# Altium project Flir_brake_out.PrjPcb
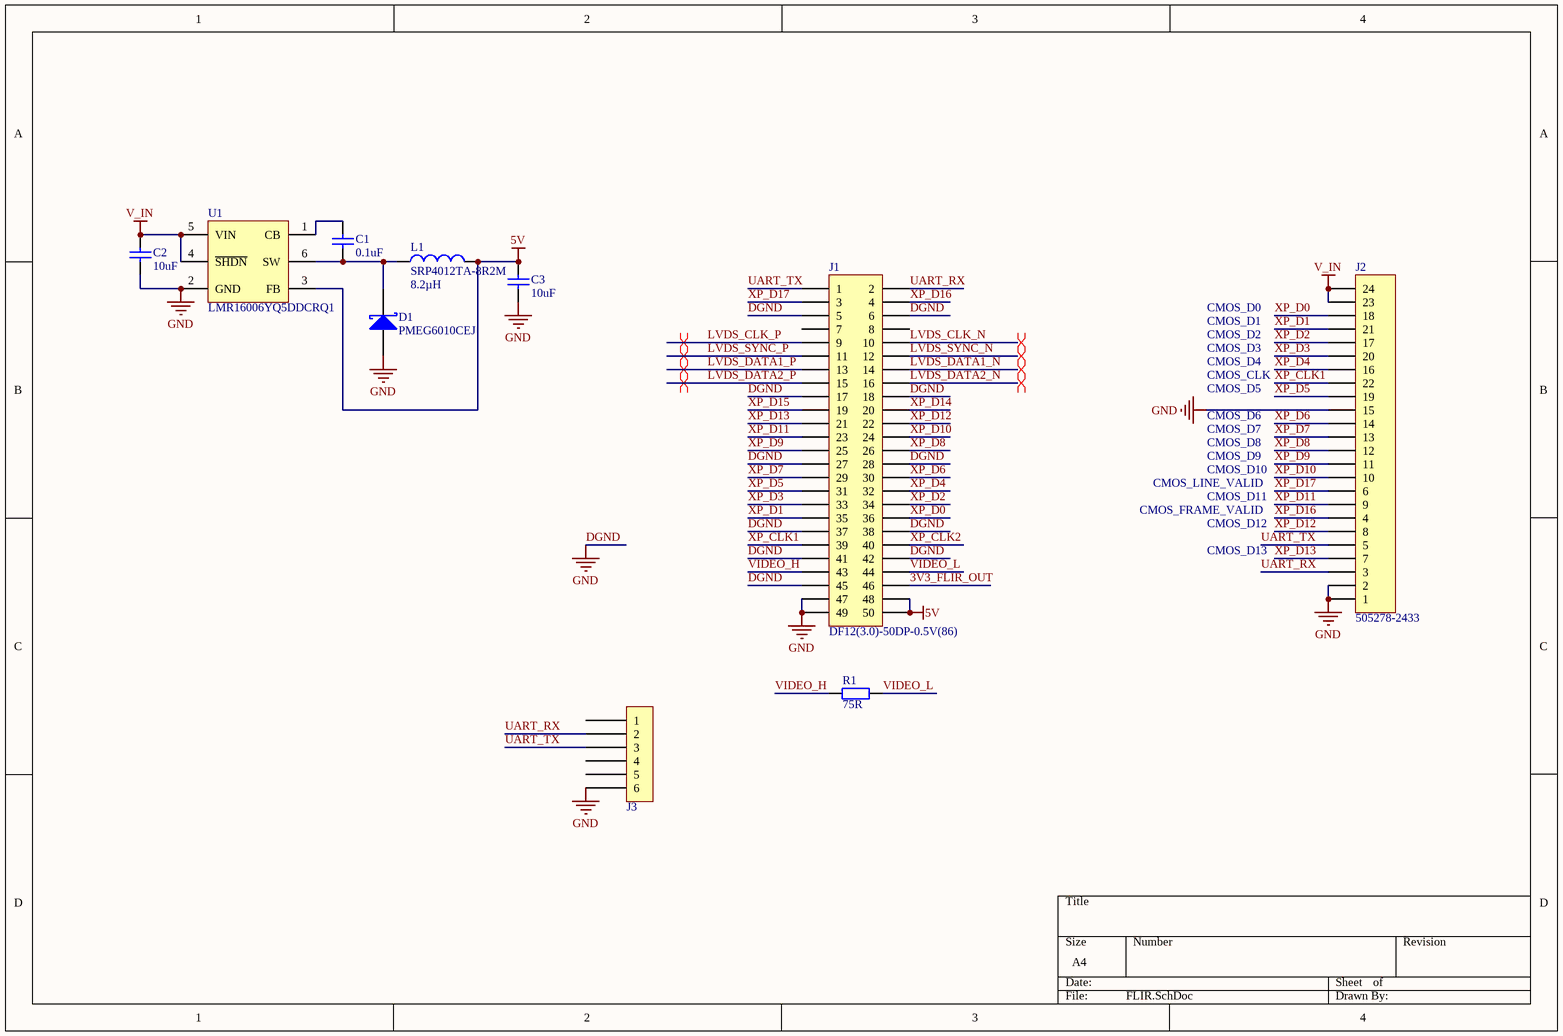
[diagram p0: FLIR.SchDoc]
1 sheet, 10 parts. Net scope: global (net labels, ports and power ports of the same name join across sheets).
Board files: Flir_PCB.PcbDoc, Flir_PCB_Panel(90x90).PcbDoc

## Sheet FLIR.SchDoc
size A4

### Parts
C1  value 0.1uF  [0603C_L]  (hidden comment: VJ0603Y104JXJPW1BC)
C2  value 10uF  [1206_1.6_L]  (hidden comment: GRM31CR61H106MA12L)
C3  value 10uF  [1206_1.6_L]  (hidden comment: TMK316B7106KL-TD)
D1  PMEG6010CEJ  [SOD323M]
J1  DF12(3.0)-50DP-0.5V(86)  [DF12(3.0)-50DP-0.5V(86)]
J2  505278-2433  [505278-2433]
J3  BM06B-GHS-TBT(LF)(SN)(N)  [BM06B-GHS-TBT]  (value not drawn)
L1  SRP4012TA-8R2M  Inductance: 8.2µH  [INDP4541X12M]
R1  value 75R  [0603R_0.45_H]  (hidden comment: CRCW060375R0FKEA)
U1  LMR16006YQ5DDCRQ1  [SOT95P280X110-6M]

### Nets
5V: C3.2 J1.48 J1.50 L1.2 U1.3(FB)
DGND: C2.1 C3.1 D1.2(A) J1.5 J1.6 J1.17 J1.18 J1.27 J1.28 J1.37 J1.38 J1.41 J1.42 J1.45 J1.47 J1.49 J2.1 J2.2 J2.15 J3.6 U1.2(GND)  [also labelled GND]
V_IN: C2.2 J2.23 J2.24 U1.4(~{SHDN}) U1.5(VIN)
3V3_FLIR_OUT: J1.46
LVDS_CLK_N: J1.10
LVDS_CLK_P: J1.9
LVDS_DATA1_N: J1.14
LVDS_DATA1_P: J1.13
LVDS_DATA2_N: J1.16
LVDS_DATA2_P: J1.15
LVDS_SYNC_N: J1.12
LVDS_SYNC_P: J1.11
UART_RX: J1.2 J2.3 J3.2
UART_TX: J1.1 J2.5 J3.3
VIDEO_H: J1.43 R1.1
VIDEO_L: J1.44 R1.2
XP_CLK1: J1.39 J2.22
XP_CLK2: J1.40
XP_D0: J1.36 J2.18
XP_D1: J1.35 J2.21
XP_D2: J1.34 J2.17
XP_D3: J1.33 J2.20
XP_D4: J1.32 J2.16
XP_D5: J1.31 J2.19
XP_D6: J1.30 J2.14
XP_D7: J1.29 J2.13
XP_D8: J1.26 J2.12
XP_D9: J1.25 J2.11
XP_D10: J1.24 J2.10
XP_D11: J1.23 J2.9
XP_D12: J1.22 J2.8
XP_D13: J1.21 J2.7
XP_D14: J1.20
XP_D15: J1.19
XP_D16: J1.4 J2.4
XP_D17: J1.3 J2.6
NetC1_1: C1.1 D1.1(K) L1.1 U1.6(SW)
NetC1_2: C1.2 U1.1(CB)

Not connected (* = marked no-connect by the designer): J1 7 8; J3 1 4 5

### Layout directives
differential pair: LVDS_CLK_N, LVDS_CLK_P, LVDS_DATA1_N, LVDS_DATA1_P, LVDS_DATA2_N, LVDS_DATA2_P, LVDS_SYNC_N, LVDS_SYNC_P

### Notes on the sheet
- CMOS_D0
- CMOS_D1
- CMOS_D2
- CMOS_D3
- CMOS_D4
- CMOS_CLK
- CMOS_D5
- CMOS_D6
- CMOS_D7
- CMOS_D8
- CMOS_FRAME_VALID
- CMOS_LINE_VALID
- CMOS_D9
- CMOS_D10
- CMOS_D11
- CMOS_D12
- CMOS_D13

### Library data of the parts
C1 = VJ0603Y104JXJPW1BC: CAP CER 0603 0.1uF 16V X7R 5%; Manufacturer: Vishay / Vitramon; Type: Ultra Small Commodity MLCCs; Voltage Rating DC: 16 VDC; Supplier 1: Mouser; Manufacturer Part Number: VJ0603Y104JXJPW1BC; RoHS: RoHS Compliant; Category: Multilayer Ceramic Capacitors MLCC - SMD/SMT; Stock 1: 30210; Pricing 1: 1=0.091, 50=0.022, 100=0.017, 500=0.015, 1000=0.014, 15000=0.011, 75000=0.010 (EUR); Height: 0.95 mm; Length: 1.6 mm; Package/Case: 0603 (1608 metric); Packaging: Reel; Product: General Type MLCCs; Series: VJ W1BC; Termination Style: SMD/SMT; Tolerance: 5 %; Voltage Rating AC: -; Width: 0.8 mm; Brand: Vishay / Vitramon; Case Code - in: 0603; Case Code - mm: 1608; Dielectric: X7R; Maximum Operating Temperature: + 125 C; Minimum Operating Temperature: - 55 C; Standard Pack Qty: 15000; RoHS - Mouser: Y; Minimum Order Quantity: 1; Reeling: True; ComponentLink1URL: http://www.mouser.com/ds/2/427/vjw1bcbascomseries-223529.pdf; ComponentLink1Description: http://www.mouser.com/ds/2/427/vjw1bcbascomseries-223529.pdf; Supplier Part Number 1: 77-VJ0603Y104JXJPBC; Capacitance: 0.1 uF
C2 = GRM31CR61H106MA12L: CAP CER 1206 10uF 50V X5R 20%; Manufacturer: Murata Electronics; Type: General Purpose Ceramic Capacitors; Voltage Rating DC: 50 VDC; Class: Class 2; Product Status: New Product; Supplier 1: Mouser; Supplier Part Number 1: 81-GRM31CR61H106MA2L; Manufacturer Part Number: GRM31CR61H106MA12L; RoHS: RoHS Compliant; Category: Multilayer Ceramic Capacitors MLCC - SMD/SMT; Stock 1: 0; Pricing 1: 1=0.308, 10=0.168, 100=0.110, 500=0.100, 1000=0.091, 2000=0.063, 10000=0.062, 24000=0.060, 50000=0.053 (EUR); Capacitance: 10 uF; Height: 1.6 mm; Length: 3.2 mm; Package/Case: 1206 (3216 metric); Packaging: Reel; Product: General Type MLCCs; Series: GRM; Termination Style: SMD/SMT; Tolerance: 20 %; Width: 1.6 mm; Brand: Murata Electronics; Case Code - in: 1206; Case Code - mm: 3216; Dielectric: X5R; Maximum Operating Temperature: + 85 C; Minimum Operating Temperature: - 55 C; Standard Pack Qty: 2000; RoHS - Mouser: Y; Minimum Order Quantity: 1; Reeling: True; ComponentLink1URL: http://www.mouser.com/ds/2/281/c02e-2905.pdf; ComponentLink1Description: http://www.mouser.com/ds/2/281/c02e-2905.pdf
C3 = TMK316B7106KL-TD: CAP CER 1206 10uF 25V X7R 10%; Manufacturer: Taiyo Yuden; Type: Multilayer Ceramic Capacitor; Voltage Rating DC: 25 VDC; Qualification: AEC-Q200; Supplier 1: Mouser; Supplier Part Number 1: 963-TMK316B7106KL-TD; Manufacturer Part Number: TMK316B7106KL-TD; RoHS: RoHS Compliant; Category: Multilayer Ceramic Capacitors MLCC - SMD/SMT; Stock 1: 113143; Pricing 1: 1=0.434, 10=0.230, 100=0.135, 500=0.105, 1000=0.082, 2000=0.063, 4000=0.059, 10000=0.055, 24000=0.052 (EUR); Capacitance: 10 uF; Height: 1.6 mm; Length: 3.2 mm; Package/Case: 1206 (3216 metric); Packaging: Reel; Product: General Type MLCCs; Series: M; Termination Style: SMD/SMT; Tolerance: 10 %; Width: 1.6 mm; Brand: Taiyo Yuden; Case Code - in: 1206; Case Code - mm: 3216; Dielectric: X7R; Maximum Operating Temperature: + 125 C; Minimum Operating Temperature: - 55 C; Standard Pack Qty: 2000; RoHS - Mouser: Y; Minimum Order Quantity: 1; Reeling: True; ComponentLink1URL: http://www.mouser.com/ds/2/396/mlcc_all_e-541559.pdf; ComponentLink1Description: http://www.mouser.com/ds/2/396/mlcc_all_e-541559.pdf
D1 = PMEG6010CEJ,115: DIODE SCHOTTKY 60V 1A SOD323F; Manufacturer: NXP USA Inc.; Current - Average Rectified (Io): 1A (DC); Voltage - Forward (Vf) (Max) @ If: 660mV @ 1A; Speed: Fast Recovery =< 500ns, > 200mA (Io); Current - Reverse Leakage @ Vr: 50µA @ 60V; Capacitance @ Vr, F: 68pF @ 1V, 1MHz; Supplier 1: Digi-Key; Supplier Part Number 1: 568-4138-1-ND; Manufacturer Part Number: PMEG6010CEJ,115; RoHS: RoHS Compliant; Category: Discrete Semiconductor Products; Stock 1: 17553; Pricing 1: 1=0.38, 10=0.308, 100=0.2102, 500=0.15734, 1000=0.11785 (USD); Packaging: Cut Tape (CT); Part Status: Active; Diode Type: Schottky; Voltage - DC Reverse (Vr) (Max): 60V; Reverse Recovery Time (trr): -; Mounting Type: Surface Mount; Package / Case: SC-90, SOD-323F; Supplier Device Package: SOD-323F; Operating Temperature - Junction: 150°C (Max); ComponentLink1URL: http://www.nxp.com/documents/data_sheet/PMEG6010CEH_PMEG6010CEJ.pdf; ComponentLink1Description: http://www.nxp.com/documents/data_sheet/PMEG6010CEH_PMEG6010CEJ.pdf
J1 = DF12(3.0)-50DP-0.5V(86): Board to Board & Mezzanine Connectors 50P V SMT DR HDR 3.0MM STACK HT GOLD; Manufacturer: Hirose Connector; Current Rating: 300 mA; Mounting Angle: Vertical; Number of Positions: 50 Position; Voltage Rating: 50 V; Pitch: 0.5 mm; Stack Height: 3 mm; Supplier 1: Mouser; Supplier Part Number 1: 798-DF123050DP0.5V86; Manufacturer Part Number: DF12(3.0)-50DP-0.5V(86); RoHS: RoHS Compliant; Category: Board to Board & Mezzanine Connectors; Stock 1: 3370; Pricing 1: 1=1.50, 10=1.22, 100=1.17, 250=1.06, 500=0.968, 1000=0.836, 2000=0.710, 5000=0.674, 10000=0.659 (EUR); Contact Plating: Gold; Number of Rows: 2 Row; Packaging: Reel; Product: Headers; Series: DF12; Termination Style: SMD; Brand: Hirose Connector; Contact Material: Phosphor Copper; Standard Pack Qty: 1000; RoHS - Mouser: Y; Minimum Order Quantity: 1; Reeling: True; ComponentLink1URL: http://www.mouser.com/ds/2/185/DF12_catalog-938983.pdf; ComponentLink1Description: http://www.mouser.com/ds/2/185/DF12_catalog-938983.pdf
J2 = 5052782433: 0.5 FFC ZIF BTM CONT EMBT PKG 24; Manufacturer: Molex, LLC; Flat Flex Type: FFC, FPC; Connector/Contact Type: Contacts, Bottom; Number of Positions: 24; Pitch: 0.020" (0.50mm); FFC, FCB Thickness: 0.30mm; Locking Feature: Flip Lock; Cable End Type: Tabbed, Tapered; Actuator Material: Polyamide (PA), Nylon, Glass Filled; Voltage Rating: 50V; Material Flammability Rating: UL94 V-0; Current Rating: 0.5A; Supplier 1: Digi-Key; Supplier Part Number 1: 5052782433-ND; Manufacturer Part Number: 5052782433; RoHS: RoHS Compliant; Category: Connectors, Interconnects; Stock 1: 0; Pricing 1: 3000=0.4308 (USD); Packaging: Tape & Reel (TR); Part Status: Active; Mounting Type: Surface Mount, Right Angle; Termination: Solder; Height Above Board: 0.075" (1.90mm); Contact Material: Phosphor Bronze; Contact Finish: Tin; Housing Material: Liquid Crystal Polymer (LCP), Glass Filled; Features: Solder Retention; Operating Temperature: -40°C ~ 85°C; ComponentLink1URL: http://www.molex.com/pdm_docs/sd/5052782433_sd.pdf; ComponentLink1Description: http://www.molex.com/pdm_docs/sd/5052782433_sd.pdf
J3 = BM06B-GHS-TBT(LF)(SN)(N): CONN HEADER GH TOP 6POS 1.25MM; Manufacturer: JST Sales America Inc.; Connector Type: Header, Shrouded; Number of Positions: 6; Number of Positions Loaded: All; Pitch: 0.049" (1.25mm); Supplier 1: Digi-Key; Supplier Part Number 1: 455-1582-1-ND; Manufacturer Part Number: BM06B-GHS-TBT(LF)(SN)(N); RoHS: RoHS Compliant; Category: Connectors, Interconnects; Stock 1: 150348; Pricing 1: 1=0.56, 10=0.524, 100=0.4019, 500=0.34948, 1000=0.28832 (USD); Packaging: Cut Tape (CT); Contact Type: Outer Shroud Contact; Number of Rows: 1; Row Spacing: -; Contact Mating Length: -; Mounting Type: Surface Mount; Termination: Solder; Fastening Type: Locking Ramp; Features: Solder Retention; Contact Finish: Tin; Contact Finish Thickness: -; Color: Natural; ComponentLink1URL: http://www.jst-mfg.com/product/pdf/eng/eGH.pdf; ComponentLink1Description: http://www.jst-mfg.com/product/pdf/eng/eGH.pdf
L1 = SRP4012TA-8R2M: FIXED IND 8.2UH 1.4A 376 MOHM; Manufacturer: Bourns Inc.; Type: Wirewound; Material - Core: Carbonyl Powder; Tolerance: ±20%; Current - Saturation: 1.6A; Shielding: Shielded; DC Resistance (DCR): 376 mOhm Max; Q @ Freq: 10 @ 100kHz; Frequency - Self Resonant: 25MHz; Frequency - Test: 100kHz; Supplier 1: Digi-Key; Supplier Part Number 1: SRP4012TA-8R2MCT-ND; Manufacturer Part Number: SRP4012TA-8R2M; RoHS: RoHS Compliant; Category: Inductors, Coils, Chokes; Stock 1: 1984; Pricing 1: 1=1.18, 10=1.11, 25=1.036, 50=0.888, 100=0.8436, 250=0.7696, 500=0.6808, 1000=0.6216 (USD); Packaging: Cut Tape (CT); Part Status: Active; Current Rating: 1.4A; Ratings: AEC-Q200; Operating Temperature: -40°C ~ 150°C; Mounting Type: Surface Mount; Package / Case: 2-SMD; Size / Dimension: 0.175" L x 0.160" W (4.45mm x 4.06mm); Height - Seated (Max): 0.047" (1.20mm); ComponentLink1URL: http://www.bourns.com/docs/Product-Datasheets/SRP4012TA.pdf; ComponentLink1Description: http://www.bourns.com/docs/Product-Datasheets/SRP4012TA.pdf
R1 = CRCW060375R0FKEA: RES SMD 75 OHM 1% 1/10W 0603; Manufacturer: Vishay Dale; Resistance (Ohms): 75; Power (Watts): 0.1W, 1/10W; Temperature Coefficient: ±100ppm/°C; Supplier 1: Digi-Key; Supplier Part Number 1: 541-75.0HCT-ND; Manufacturer Part Number: CRCW060375R0FKEA; RoHS: RoHS Compliant; Category: Resistors; Stock 1: 102359; Pricing 1: 1=0.1, 10=0.03, 25=0.022, 50=0.0168, 100=0.0123, 250=0.0094, 500=0.00752, 1000=0.00554, 2500=0.00481 (USD); Packaging: Cut Tape (CT); Part Status: Active; Tolerance: ±1%; Composition: Thick Film; Features: Automotive AEC-Q200; Operating Temperature: -55°C ~ 155°C; Package / Case: 0603 (1608 Metric); Supplier Device Package: 0603; Size / Dimension: 0.063" L x 0.033" W (1.60mm x 0.85mm); Height - Seated (Max): 0.020" (0.50mm); Number of Terminations: 2; Failure Rate: -; ComponentLink1URL: http://www.vishay.com/docs/20035/dcrcwe3.pdf; ComponentLink1Description: http://www.vishay.com/docs/20035/dcrcwe3.pdf
U1 = LMR16006YQ5DDCRQ1: IC REG BUCK 5V 0.6A 6SOT; Manufacturer: Texas Instruments; Function: Step-Down; Output Configuration: Positive; Output Type: Fixed; Number of Outputs: 1; Voltage - Input (Min): 4V; Voltage - Input (Max): 40V; Current - Output: 600mA; Frequency - Switching: 2.1MHz; Synchronous Rectifier: No; Supplier 1: Digi-Key; Supplier Part Number 1: 296-42515-1-ND; Manufacturer Part Number: LMR16006YQ5DDCRQ1; RoHS: RoHS Compliant; Category: Integrated Circuits (ICs); Stock 1: 2026; Pricing 1: 1=3.48, 10=3.121, 100=2.5607, 500=2.17854, 1000=1.5925 (USD); Packaging: Cut Tape (CT); Part Status: Active; Topology: Buck; Voltage - Output (Min/Fixed): 5V; Voltage - Output (Max): -; Operating Temperature: -40°C ~ 125°C (TJ); Mounting Type: Surface Mount; Package / Case: SOT-23-6 Thin, TSOT-23-6; Supplier Device Package: 6-SOT; ComponentLink1URL: http://www.ti.com/lit/ds/symlink/lmr16006y-q1.pdf; ComponentLink1Description: http://www.ti.com/lit/ds/symlink/lmr16006y-q1.pdf